# Altium schematic sheet Top sheet.SchDoc
size A4
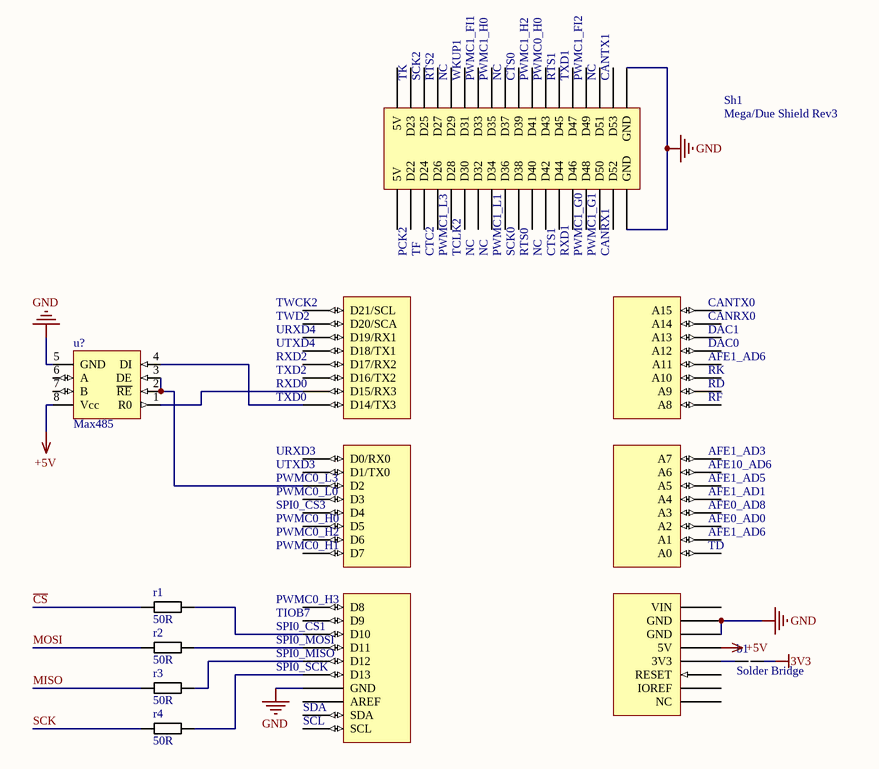
[diagram p0: Top sheet.SchDoc]

## Parts
b1  Solder Bridge  [Solder Bridge]
r1  50R  [0805]
r2  50R  [0805]
r3  50R  [0805]
r4  50R  [0805]
Sh1  Mega/Due Shield Rev3  [Mega2560_R3 Shield]
u?  Max485  [SOIC8N]

## Nets
3V3: b1.2
+5V: Sh1.5(5V) u?.8(Vcc)
GND: Sh1.6(GND) Sh1.7(GND) Sh1.47(GND) Sh1.83(GND) Sh1.84(GND) u?.5(GND)
~{CS}: r1.1
MISO: r3.1
MOSI: r2.1
SCK: r4.1
Netb1_1: b1.1 Sh1.4(3V3)
Netr1_2: r1.2 Sh1.43(D10)
Netr2_2: r2.2 Sh1.44(D11)
Netr3_2: r3.2 Sh1.45(D12)
Netr4_2: r4.2 Sh1.46(D13)
NetSh1_31: Sh1.31(D15/RX3) u?.1(R0)
NetSh1_32: Sh1.32(D14/TX3) u?.4(DI)
NetSh1_35: Sh1.35(D2) u?.2(~{RE}) u?.3(DE)

Not connected (* = marked no-connect by the designer): Sh1 1(NC) 2(IOREF) 3(RESET) 8(VIN) 9(A0) 10(A1) 11(A2) 12(A3) 13(A4) 14(A5) 15(A6) 16(A7) 17(A8) 18(A9) 19(A10) 20(A11) 21(A12) 22(A13) 23(A14) 24(A15) 25(D21/SCL) 26(D20/SCA) 27(D19/RX1) 28(D18/TX1) 29(D17/RX2) 30(D16/TX2) 33(D0/RX0) 34(D1/TX0) 36(D3) 37(D4) 38(D5) 39(D6) 40(D7) 41(D8) 42(D9) 48(AREF) 49(5V) 50(5V) 51(D22) 52(D23) 53(D24) 54(D25) 55(D26) 56(D27) 57(D28) 58(D29) 59(D30) 60(D31) 61(D32) 62(D33) 63(D34) 64(D35) 65(D36) 66(D37) 67(D38) 68(D39) 69(D40) 70(D41) 71(D42) 72(D43) 73(D44) 74(D45) 75(D46) 76(D47) 77(D48) 78(D49) 79(D50) 80(D51) 81(D52) 82(D53); u? 6(A) 7(B)

## Notes on the sheet
- (near Sh1) TK
- (near Sh1) SCK2
- (near Sh1) RTS2
- (near Sh1) NC
- (near Sh1) WKUP1
- (near Sh1) PWMC1_FI1
- (near Sh1) PWMC1_H0
- (near Sh1) CTS0
- (near Sh1) PWMC1_H2
- (near Sh1) PWMC0_H0
- (near Sh1) RTS1
- (near Sh1) TXD1
- (near Sh1) PWMC1_FI2
- (near Sh1) CANTX1
- (near Sh1) PCK2
- (near Sh1) TF
- (near Sh1) CTC2
- (near Sh1) PWMC1_L3
- (near Sh1) TCLK2
- (near Sh1) PWMC1_L1
- (near Sh1) SCK0
- (near Sh1) RTS0
- (near Sh1) CTS1
- (near Sh1) RXD1
- (near Sh1) PWMC1_G0
- (near Sh1) PWMC1_G1
- (near Sh1) CANRX1
- (near Sh1) URXD4
- (near Sh1) TWD2
- (near Sh1) TWCK2
- (near Sh1) DAC1
- (near Sh1) CANRX0
- (near Sh1) CANTX0
- (near Sh1) TXD0
- (near Sh1) RXD0
- (near Sh1) RXD2
- (near Sh1) TXD2
- (near Sh1) UTXD4
- (near Sh1) RF
- (near Sh1) RD
- (near Sh1) RK
- (near Sh1) AFE1_AD6
- (near Sh1) DAC0
- (near Sh1) UTXD3
- (near Sh1) URXD3
- (near Sh1) AFE10_AD6
- (near Sh1) AFE1_AD3
- (near Sh1) PWMC0_H2
- (near Sh1) SPI0_CS3
- (near Sh1) PWMC0_L0
- (near Sh1) PWMC0_L3
- (near Sh1) AFE0_AD0
- (near Sh1) AFE0_AD8
- (near Sh1) AFE1_AD1
- (near Sh1) AFE1_AD5
- (near Sh1) PWMC0_H3
- (near Sh1) PWMC0_H1
- (near Sh1) TD
- (near Sh1) SPI0_SCK
- (near Sh1) SPI0_MISO
- (near Sh1) SPI0_MOSI
- (near Sh1) SPI0_CS1
- (near Sh1) TIOB7
- (near Sh1) SCL
- (near Sh1) SDA

## Library data of the parts
r1-r4 = 0805 Resistor: ...R
u? = Max485: SOIC8